# Altium project mobile_robot_pcb.PrjPcb
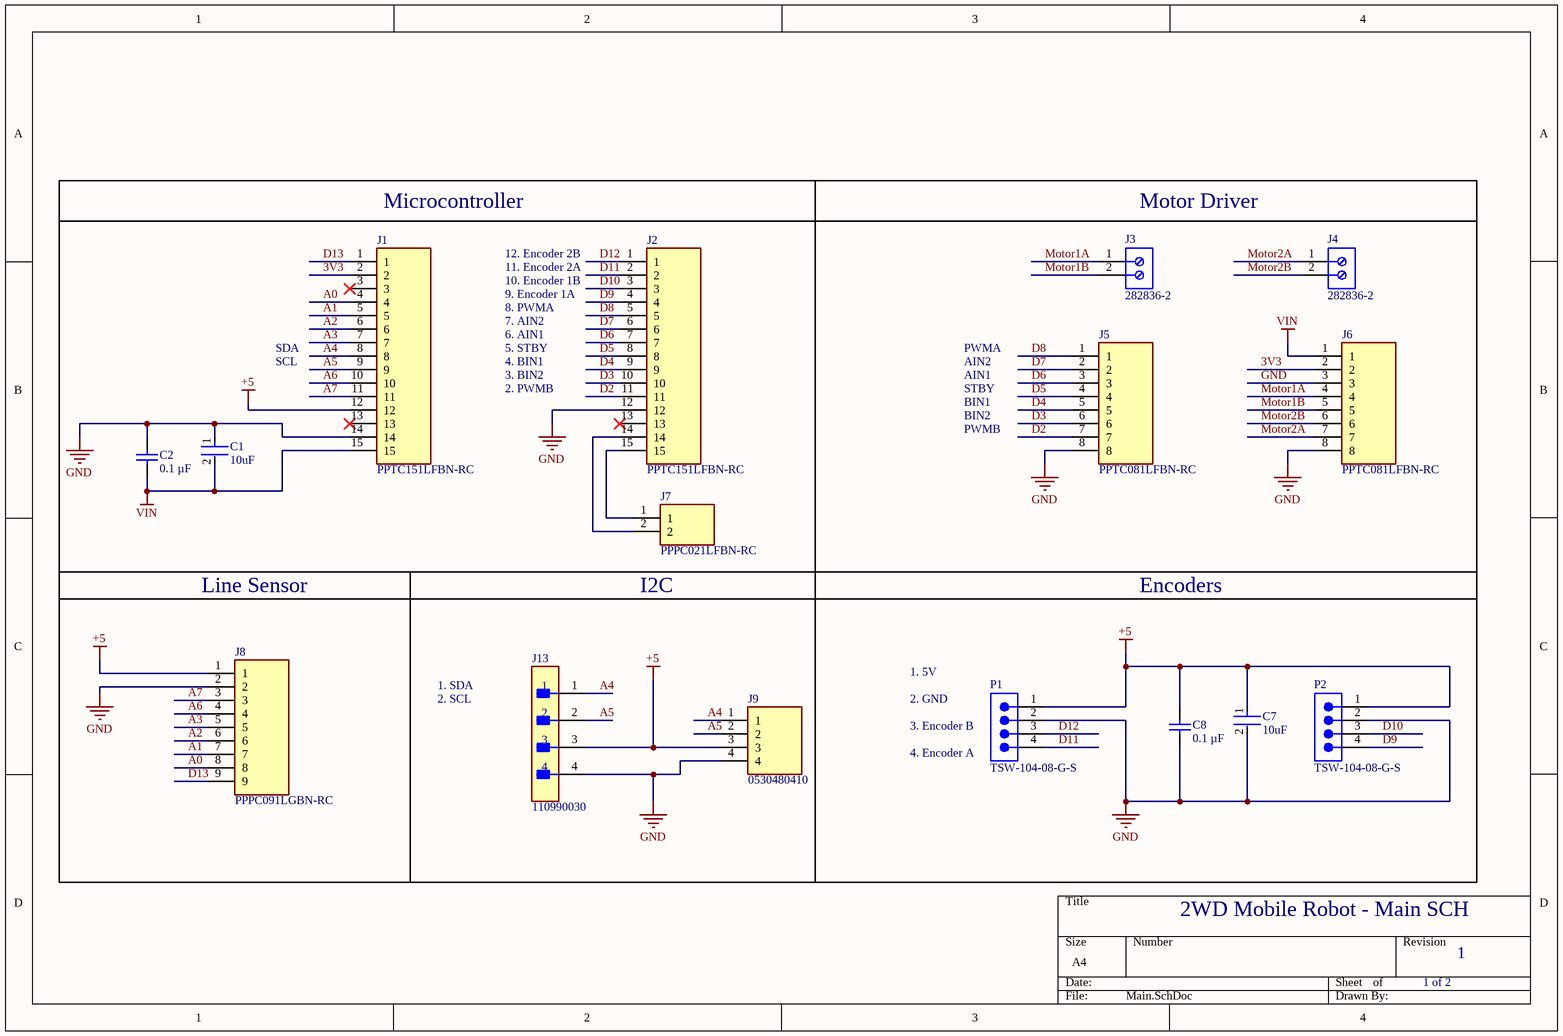
[diagram p0: Main.SchDoc]
2 sheets, 27 parts. Net scope: global (net labels, ports and power ports of the same name join across sheets).
Board file: PCB.PcbDoc
Sheets:
  Main.SchDoc
  Power.SchDoc

## Sheet Main.SchDoc: 2WD Autonomous Mobile Robot
size A4; SheetNumber: 1; SheetTotal: 2

### Parts
C1  10uF  [FP-GRM21B-0_2-e0_2_0_7-IPC_C]
C2  0.1 µF  [CAPC2013X140X50ML20T25]
C7  10uF  [FP-GRM21B-0_2-e0_2_0_7-IPC_C]
C8  0.1 µF  [CAPC2013X140X50ML20T25]
J1  PPTC151LFBN-RC  [RHDR15W85P0X254_1X15_3708X254X850P]
J2  PPTC151LFBN-RC  [RHDR15W85P0X254_1X15_3708X254X850P]
J3  282836-2  [TECO-282836-2_V]
J4  282836-2  [TECO-282836-2_V]
J5  PPTC081LFBN-RC  [RHDR8W80P0X254_1X8_2082X254X850P]
J6  PPTC081LFBN-RC  [RHDR8W80P0X254_1X8_2082X254X850P]
J7  PPPC021LFBN-RC  [RHDR2W80P0X254_1X2_558X254X850P]
J8  PPPC091LGBN-RC  [RHDRRA9W60P0X254_1X9_2336X850X274P]
J9  0530480410  [SHDRRA4W35P0X125_1X4_675X550X350P]
J13  110990030  [FP-110990030-MFG]
P1  TSW-104-08-G-S  [SMTC-TSW-104-08-X-S]
P2  TSW-104-08-G-S  [SMTC-TSW-104-08-X-S]

### Nets
+5: C7.1 C8.2 J1.12 J8.1 J9.3 J13.3 P1.1 P2.1
GND: C1.1 C2.2 C7.2 C8.1 J1.14 J2.12 J5.8 J6.3 J6.8 J8.2 J9.4 J13.4 P1.2 P2.2
VIN: C1.2 C2.1 J1.15 J6.1
3V3: J1.2 J6.2
A0: J1.4 J8.8
A1: J1.5 J8.7
A2: J1.6 J8.6
A3: J1.7 J8.5
A4: J1.8 J9.1 J13.1
A5: J1.9 J9.2 J13.2
A6: J1.10 J8.4
A7: J1.11 J8.3
D2: J2.11 J5.7
D3: J2.10 J5.6
D4: J2.9 J5.5
D5: J2.8 J5.4
D6: J2.7 J5.3
D7: J2.6 J5.2
D8: J2.5 J5.1
D9: J2.4 P2.4
D10: J2.3 P2.3
D11: J2.2 P1.4
D12: J2.1 P1.3
D13: J1.1 J8.9
Motor1A: J3.1 J6.4
Motor1B: J3.2 J6.5
Motor2A: J4.1 J6.7
Motor2B: J4.2 J6.6
NetJ2_14: J2.14 J7.2
NetJ2_15: J2.15 J7.1

Not connected (* = marked no-connect by the designer): J1 3* 13*; J2 13*

### Notes on the sheet
- (near J1) Microcontroller
- Motor Driver
- 12. Encoder 2B
- 11. Encoder 2A
- 10. Encoder 1B
- 9. Encoder 1A
- 8. PWMA
- SDA
- SCL
- 7. AIN2
- 6. AIN1
- 5. STBY
- 4. BIN1
- 3. BIN2
- PWMA
- AIN2
- AIN1
- 2. PWMB
- STBY
- BIN1
- BIN2
- PWMB
- Line Sensor
- (near J7) I2C
- Encoders
- 1. SDA
- 2. SCL
- 2. GND
- 1. 5V
- (near P1) 4. Encoder A
- (near P1) 3. Encoder B
- 2WD Mobile Robot - Main SCH
- 1 of 2
- 1

### Library data of the parts
C1 C7 = CMP-06035-048920-1: Chip Multilayer Ceramic Capacitors for General Purpose, 0805, 10uF, X5R, 15%, 10%, 35V; Manufacturer Product Number: GRM21BR6YA106KE43L; Max Operating Temperature: 85°C; REACH SVHC: No SVHC; Packaging: Tape and Reel; Thickness: 0.057inch; Tolerance: 10%; Capacitance: 10uF; Case Code (Imperial): 0805; Height: 1.25mm; Width: 0.049inch; Length: 0.079inch; Lead Free: Lead Free; Voltage Rating: 35V; Case/Package: 0805; Dielectric: X5R; Min Operating Temperature: -55°C; Package Quantity: 3000; Termination: SMD/SMT; Case Code (Metric): 2012; Weight: 0.000335oz; Mount: Surface Mount; Voltage Rating (DC): 35V
C2 C8 = CMP-2007-04651-1: 0.1 µF ±10% 35V Ceramic Capacitor X5R 0805 (2012 Metric); Part Number: 0805DD104KAT2A; Manufacturer: AVX Interconnect / Elco
J1 J2 = PPTC151LFBN-RC: Connector; Manufacturer_Name: Sullins; Datasheet Link: https://www.digikey.com/en/products/detail/sullins-connector-solutions/PPTC151LFBN-RC/810153; Height: 8.5mm; Manufacturer_Part_Number: PPTC151LFBN-RC
J3 J4 = CMP-1684-00017-1: Female Header, Pitch 5 mm, 1 x 2 Position, Height 10 mm, Tail Length 3.5 mm, Rohs, Bulk; Manufacturer: TE Connectivity; Wire Gauge: 16-30AWG; Product Training Modules: Wire-to-BoardEurostyleTerminalBlocks; Clamp Material - Plating: Brass-NickelPlated; Voltage: 300V; Mating Orientation: HorizontalwithBoard; Current: 13.5A; Pitch: 0.197"(5.00mm); Screw Thread: M3; 3D Model: 282836-2.pdf; Other Names: 5ULV-02B / A98076; Dynamic Catalog: BuchananSeries; Number of Levels: 1; Torque - Screw: 0.68Nm(6Lb-In); Featured Product: EurostyleTerminalBlockConnectors; Positions Per Level: 2; Wire Termination: Screw-RisingCageClamp; Datasheet URL: http://www.te.com.cn/commerce/DocumentDelivery/DDEController?Action=showdoc&DocId=Catalog+Section%7F1308389_EUROSTYLE_TERMINAL_BLOCKS%7F0607%7Fpdf%7FEnglish%7FENG_CS_1308389_EUROSTYLE_TERMINAL_BLOCKS_0607.pdf%7F282836-2; Color: Green; Family: TerminalBlocks-WiretoBoard; RoHS Information: 282836-2StatementofCompliance; Standard Package: 300; Contact Material - Plating: Brass-TinPlated; Manufacturer URL: http://www.te.com; Housing Material: Polyamide(PA66),Nylon6/6; Features: Interlocking(Side); Package Description: Female Header, Pitch 5 mm, 1 x 2 Position, Height 10 mm, Tail Length 3.5 mm; Mounting Type: ThroughHole; Package Reference: THD; Packaging: Bulk; Series: Buchanan; Category: Connectors,Interconnects; Screw Material - Plating: Brass-NickelPlated
J5 J6 = PPTC081LFBN-RC: Connector; Manufacturer_Name: Sullins; Datasheet Link: http://sullinscorp.com/catalogs/101_PAGE114-115_.100_FEMALE_HDR.pdf; Height: 8.5mm; Manufacturer_Part_Number: PPTC081LFBN-RC
J7 = PPPC021LFBN-RC: Connector; Manufacturer_Name: Sullins; Datasheet Link: http://www.sullinscorp.com/drawings/78_P(N)PxCxxxLFBN-RC,_10492-H.pdf; Height: 8.5mm; Manufacturer_Part_Number: PPPC021LFBN-RC
J8 = PPPC091LGBN-RC: Connector; Manufacturer_Name: Sullins; Datasheet Link: http://www.sullinscorp.com/drawings/78_P(N)PxCxx1LGBN-RC,_10493-G.pdf; Height: 2.74mm; Manufacturer_Part_Number: PPPC091LGBN-RC
J9 = 0530480410: Connector; Manufacturer_Name: Molex; Datasheet Link: http://www.molex.com/pdm_docs/sd/530480410_sd.pdf; Height: 3.5mm; Manufacturer_Part_Number: 0530480410; Mouser Part Number: N/A; Mouser Price/Stock: https://www.mouser.co.uk/ProductDetail/Molex/0530480410?qs=PBcRNPEHKsr6e1Q9gctk8A%3D%3D; Arrow Part Number: 0530480410; Arrow Price/Stock: https://www.arrow.com/en/products/0530480410/molex
J13 = CMP-139044-000001-1: GROVE 2MM 4PIN VERT CONN 10PCS; Series: -
P1 P2 = CMP-1024-00357-1: 0.025" SQ Post Header, Through-hole, Vertical, -55 to 125 degC, 2.54 mm Pitch, 4-Pin, Male, RoHS; Manufacturer: Samtec; Pitch: 2.54 mm; RoHS: True; ComponentLink3URL: http://www.samtec.com/documents/webfiles/cpdf/TSW-XXX-XX-XXX-X-XX-XXX-MKT.pdf; Mounting Technology: Through-hole; ComponentLink2URL: http://www.samtec.com/documents/webfiles/pdf/TSW_TH.PDF; ComponentLink1URL: http://www.samtec.com; ComponentLink3Description: Package Specification; PackageVersion: DM, 8/1988; ComponentLink2Description: Datasheet; PackageReference: TSW-104-08-X-S; PackageDescription: .025[0.64] SQ. Post Terminal Strip Assembly; PartNumber: TSW-104-08-G-S; ComponentLink1Description: Manufacturer URL; Temperature Range: -55 to 125 degC; DatasheetVersion: F-214; Orientation: Vertical

## Sheet Power.SchDoc
size A4; SheetNumber: 2; SheetTotal: 2
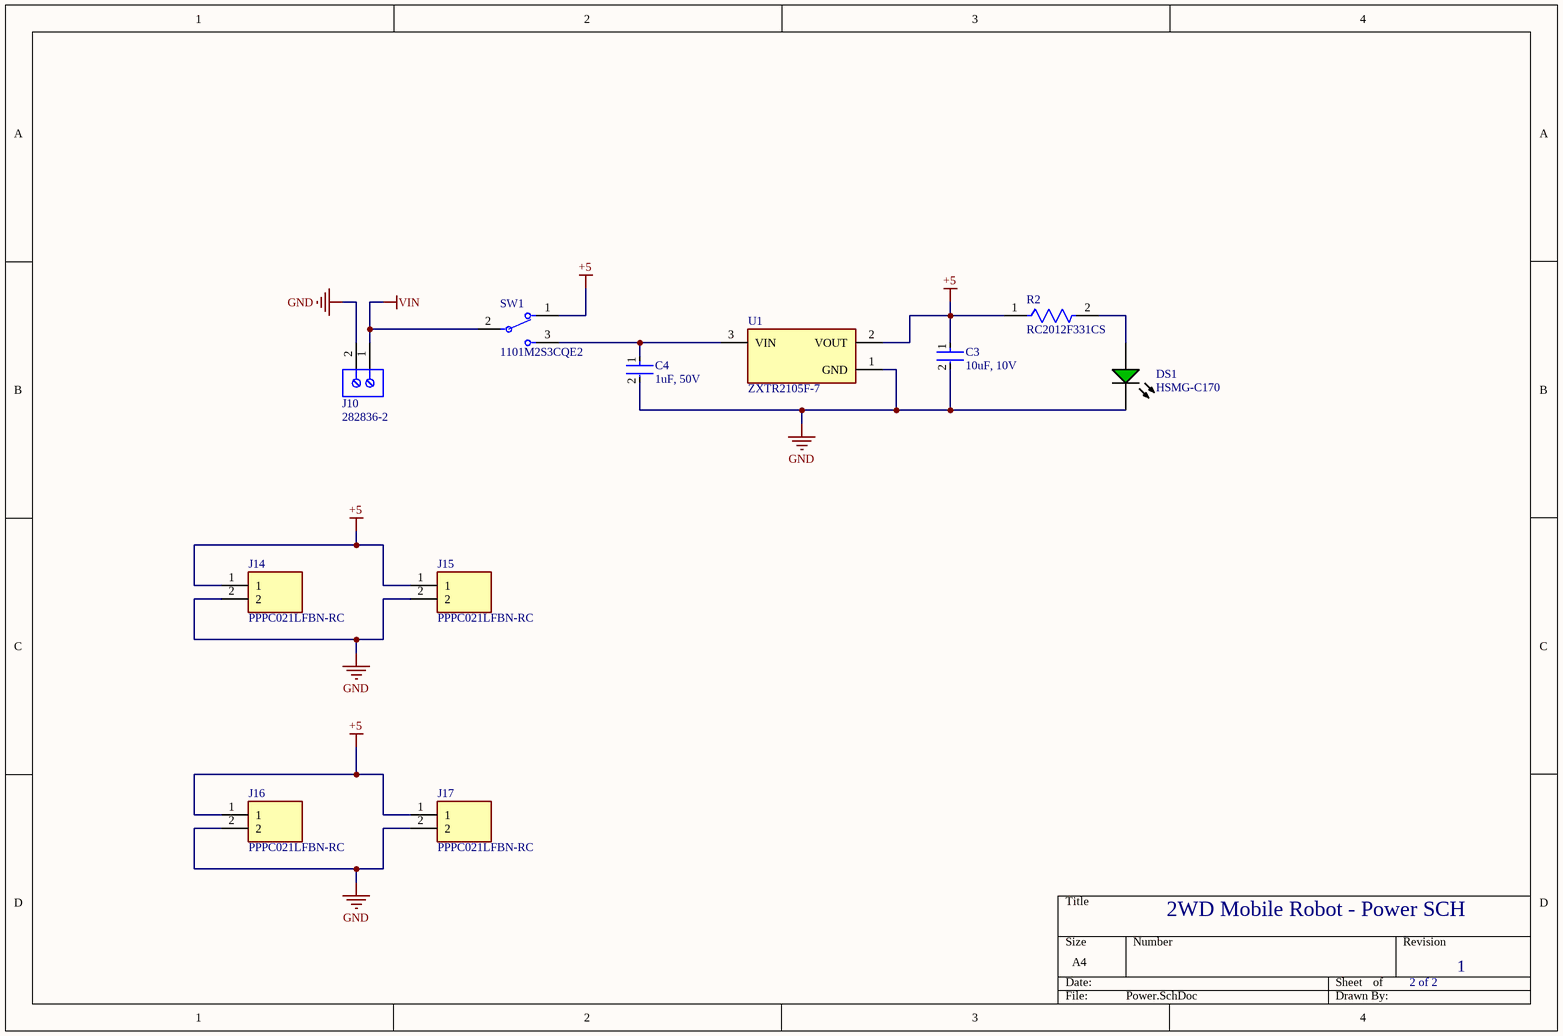
[diagram p1: Power.SchDoc]

### Parts
C3  10uF, 10V  [FP-C0805C-DG-MFG]
C4  1uF, 50V  [FP-C2012-125-0_2-IPC_A]
DS1  HSMG-C170  [AVAG-HSMX-C170_V]
J10  282836-2  [TECO-282836-2_V]
J14  PPPC021LFBN-RC  [RHDR2W80P0X254_1X2_558X254X850P]
J15  PPPC021LFBN-RC  [RHDR2W80P0X254_1X2_558X254X850P]
J16  PPPC021LFBN-RC  [RHDR2W80P0X254_1X2_558X254X850P]
J17  PPPC021LFBN-RC  [RHDR2W80P0X254_1X2_558X254X850P]
R2  RC2012F331CS  [FP-RC2012-MFG]
SW1  1101M2S3CQE2  [FP-1101M2S3CQE2-MFG]
U1  ZXTR2105F-7  [FP-SOT23-MFG]

### Nets
+5: C3.1 J14.1 J15.1 J16.1 J17.1 R2.1 SW1.1 U1.2(VOUT)
GND: C3.2 C4.2 DS1.2(K) J10.2 J14.2 J15.2 J16.2 J17.2 U1.1(GND)
VIN: J10.1 SW1.2(COMM)
NetC4_1: C4.1 SW1.3 U1.3(VIN)
NetDS1_1: DS1.1(A) R2.2

### Notes on the sheet
- 2WD Mobile Robot - Power SCH
- 2 of 2
- 1

### Library data of the parts
C3 = CMP-2007-03243-2: CAP CER 10UF 10V X5R 0805; Manufacturer Part Number: C0805C106K8PACTU; Manufacturer: Kemet; 3DS Part Number: 220-00001; Manufacturer Product Number: C0805C106K8PAC7800; Tolerance: 10%; Temperature Coefficient: 15%; Material: Ceramic; Device Class L2: Capacitors; Device Class L1: Passive Components; ComponentLink2URL: https://content.kemet.com/datasheets/KEM_C1006_X5R_SMD.pdf; Height: 1.4mm; Lead Free: Yes; Digikey Description: CAP CER 10UF 10V X5R 0805; Octopart: https://octopart.com/c0805c106k8pactu-kemet-98697; Capacitance: 10uF; Value: 10uF; Temperature Range Low: -55°C; Temperature: -55°C to +85°C; Automotive: No; Mouser Description: CAP CER 10UF 10V X5R 0805; Ipc Land Pattern Name: CAPC200125X125; Temperature Range High: +85°C; Voltage: 10V; RoHS: TRUE; Device Class L3: Ceramic Capacitors; ComponentLink2Description: Datasheet; Voltage Rating: 10V; Package: C0805C-DG; Temperature Characteristic: X5R; Category: Cap
C4 = CMP-08246-005414-1: Multilayer Ceramic Capacitors 1μF ±10% 50V JB SMD 0805; Manufacturer Product Number: C2012JB1H105K125AB; Packaging: Tape and Reel; Resistor Type: Ceramic; Width: 0.049inch; Dielectric Material: Ceramic; Height: 1.25mm; Lead Free: Lead Free; Case Code (Metric): 2012; Thickness: 0.057inch; Mount: Surface Mount; Voltage Rating: 50V; Length: 0.079inch; Voltage Rating (DC): 50V; Max Operating Temperature: 85°C; Series: C; Min Operating Temperature: -25°C; Termination: SMD/SMT; Package Quantity: 2000; Tolerance: 10%; Case/Package: 0805; RoHS Compliant: Yes; Capacitance: 1uF; Case Code (Imperial): 0805
DS1 = CMP-2000-05062-1: Chip LED, Green, 2.2 V, -40 to 85 degC, 2-Pin SMD, Pb-Free, Tape and Reel; Manufacturer: Avago; No. of Pins: 2; Peak Wavelength: 570nm; SVHC: NoSVHC(16-Jun-2014); Dominant Wavelength: 572nm; Forward Current If: 20mA; Viewing Angle: 170deg; Lens Shape: Rectangular; PIV Max: 5V; External Width: 1.25mm; LED Type: Standard; External Depth: 0.8mm; Opto Mounting Orientation: Top; Luminous Intensity: 15mcd; Luminous Intensity Min: 4mcd; Forward Voltage VF Max: 2.6V; External Length / Height: 2mm; Bulb Size: 1.25mmx1.4mm; Light Area Height: 1mm; Voltage Vf Typ: 2.2V; Operating Temperature Max: 85degC; Datasheet Version: Oct-08; MSL: MSL2A-4weeks; Peak Forward Current: 20mA; Package Description: 2-Pin Surface Mount Device, Body 2 x 1.25 mm, Height 0.8 mm; Datasheet URL: https://datasheet.ciiva.com/29280/180495-da-01-en-chip-led-hsmg-c170-gelb-gruen-29280971.pdf; Storage Temperature Min: -40degC; LED Colour: Green; Wavelength Typ: 570nm; Mounting Type: SMD; Forward Current If Max: 20mA; Dominant Wavelength Typ: 572nm; LED Mounting: SMD; Operating Temperature Range: -30degCto+85degC; Operating Temperature Min: -30degC; Manufacturer URL: http://www.avagotech.com/; Packaging: CutTape; Luminous Intensity Typ: 15mcd; Package Reference: HSMX-C170; Storage Temperature Max: 85degC; Opto Case Style: SMD; Forward Voltage: 2.2V
J10 = CMP-1684-00017-1: as J3 on sheet Main; Datasheet URL: http://www.te.com.cn/commerce/DocumentDelivery/DDEController?Action=showdoc&DocId=Catalog+Section%7F1308389_EUROSTYLE_TERMINAL_BLOCKS%7F0607%7Fpdf%7FEnglish%7FENG_CS_1308389_EUROSTYLE_TERMINAL_BLOCKS_0607.pdf%7F282836-2; Color: Green; Family: TerminalBlocks-WiretoBoard; RoHS Information: 282836-2StatementofCompliance; Standard Package: 300; Contact Material - Plating: Brass-TinPlated; Manufacturer URL: http://www.te.com; Housing Material: Polyamide(PA66),Nylon6/6; Features: Interlocking(Side); Package Description: Female Header, Pitch 5 mm, 1 x 2 Position, Height 10 mm, Tail Length 3.5 mm; Mounting Type: ThroughHole; Package Reference: THD; Packaging: Bulk; Series: Buchanan; Category: Connectors,Interconnects; Screw Material - Plating: Brass-NickelPlated
J14-J17 = PPPC021LFBN-RC: Connector; Manufacturer_Name: Sullins; Datasheet Link: http://www.sullinscorp.com/drawings/78_P(N)PxCxxxLFBN-RC,_10492-H.pdf; Height: 8.5mm; Manufacturer_Part_Number: PPPC021LFBN-RC
R2 = CMP-13261-000745-1: Res Thick Film 0805 330Ω 1% 0.125W ±100ppm/°C Molded SMD T/R; Voltage Rating (DC): 150V; Resistance: 330R; Power Rating: 125mW; Military Standard: Not; Package Quantity: 1; Radiation Hardening: No; Height: 0.024inch; Case Code (Metric): 2012; Features: Moisture Resistant; Packaging: Tape and Reel; Depth: 1.25mm; Min Operating Temperature: -55°C; Width: 0.049inch; Temperature Coefficient: 100ppm/°C; Lead Free: Lead Free; Length: 0.079inch; Tolerance: 1%; Contact Plating: Tin; Case Code (Imperial): 0805; Composition: Thick Film; Number of Terminations: 2; Max Operating Temperature: 155°C; Max Power Dissipation: 125mW; Case/Package: 0805
SW1 = CMP-10038-000019-1: SWITCH SLIDE SPDT 6A 120V; Switch Travel: 2.16mm; Number of Positions: 3; Number of Poles: 1; Approvals: UL; Actuator Length: 5.08mm; Voltage Rating (DC): 28V; Max Voltage Rating (AC): 250V; Insulation Resistance: 1GR; Body Material: Stainless Steel; Actuator Type: Standard; Contact Resistance: 10mR; Switch Function: On-On; Actuator Material: Nylon; Actuator Color: Black; Electrical Life: 40000Cycles; Termination: PC Pins; Packaging: Bulk; Housing Material: Stainless Steel; Flammability Rating: UL94 V-0; Series: 1000; Contact Current Rating: 6A; Length: 12.7mm; Depth: 6.6mm; Orientation: Vertical; Max Current Rating: 6A; Max Operating Temperature: 65°C; Throw Configuration: SPDT; REACH SVHC: No SVHC; Contact Material: Copper; Max Voltage Rating (DC): 28V; Lead Free: Lead Free; Current Rating: 6A; Voltage Rating (AC): 120V; Contact Plating: Silver; Package Quantity: 1; Min Operating Temperature: -30°C; Mount: Through Hole
U1 = CMP-12756-000045-1: IC REG LINEAR 5V 89MA SOT23; Number of Outputs: 1; Max Power Dissipation: 625mW; Output Type: Fixed; Output Current: 15mA; Max Input Voltage: 60V; Min Input Voltage: 7V; Number of Pins: 23; Lead Free: Lead Free; Mount: Surface Mount; Min Operating Temperature: -65°C; RoHS Compliant: Yes; Packaging: Tape and Reel; Max Operating Temperature: 150°C; Package Quantity: 3000; Case/Package: TO-236-3; Number of Regulators: 1; Output Voltage: 5V

## Nets that join several sheets
+5: Main (8 pins), Power (8 pins)
GND: Main (14 pins), Power (9 pins)
VIN: Main (C1.2 C2.1 J1.15 J6.1), Power (J10.1 SW1.2)